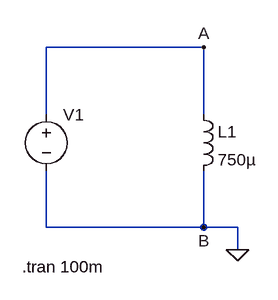
[diagram p0: schematic PR8.asc]
PR8.asc, the LTspice schematic file:
Version 4
SHEET 1 880 680
WIRE 336 16 112 16
WIRE 112 112 112 16
WIRE 336 112 336 16
WIRE 112 272 112 192
WIRE 336 272 336 192
WIRE 336 272 112 272
WIRE 384 272 336 272
WIRE 384 304 384 272
FLAG 384 304 0
FLAG 336 16 A
FLAG 336 272 B
SYMBOL voltage 112 96 R0
WINDOW 3 24 44 Invisible 2
WINDOW 123 0 0 Left 0
WINDOW 39 0 0 Left 0
SYMATTR InstName V1
SYMATTR Value PULSE(0 150m 0 0.01u 0.01u 50m)
SYMBOL ind 320 96 R0
SYMATTR InstName L1
SYMATTR Value 750µ
SYMATTR SpiceLine Rser=0.001u
TEXT 78 328 Left 2 !.tran 100m

The netlist it stands for:
* PR8.asc
V1 A 0 PULSE(0 150m 0 0.01u 0.01u 50m)
L1 A 0 750µ Rser=0.001u
.tran 100m
.backanno
.end